# EAGLE design afraid_of_the_dark (EAGLE 6.4)
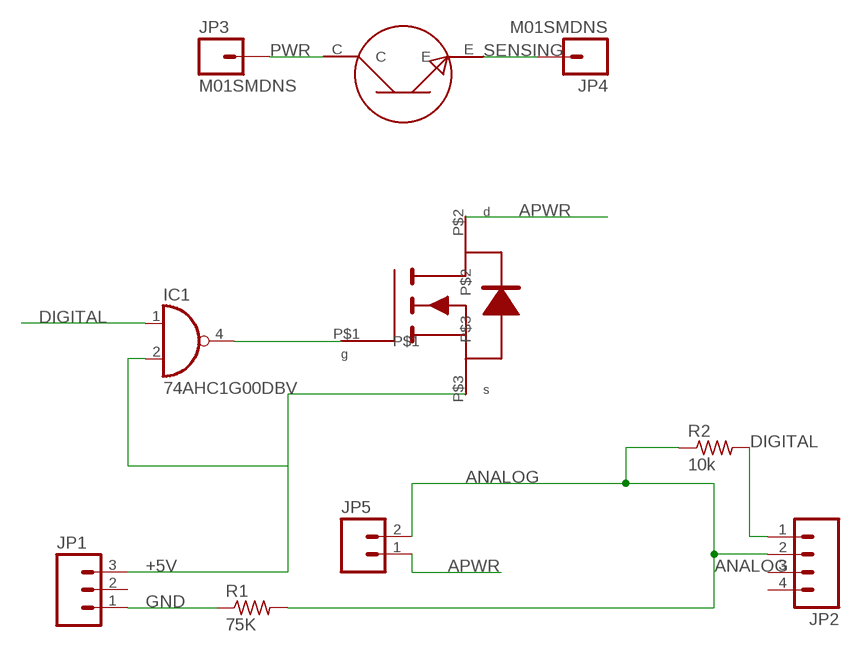
[diagram p0: schematic, sheet 1]

## Parts
IC1  74AHC1G00DBV  [SOT23-5]
JP1  M03PTH  [1X03]
JP2  M04PTH  [1X04]
JP3  M01SMDNS  [1X01NS]
JP4  M01SMDNS  [1X01NS]
JP5  M023.5MM  [SCREWTERMINAL-3.5MM-2]
R1  75K  R-US_R0805  [R0805]
R2  10k  R-US_R0805  [R0805]
U1  AMBIENT_LIGHT_SENSOR  [AMBIENT_LIGHT_SENSOR]
U3  SI2302DS_MOSFET  [SI2302DS_MOSFET]

## Nets
+5V: IC1.2(I1) JP1.3 U3.P$3
ANALOG: JP2.2 JP5.2 R1.2 R2.1
APWR: JP5.1 U3.P$2
DIGITAL: IC1.1(I0) JP2.1 R2.2
GND: JP1.1 R1.1
N$1: IC1.4(O) U3.P$1
PWR: JP3.1 U1.C
SENSING: JP4.1 U1.E
Unconnected: JP1.2 JP2.3 JP2.4

## Power pins joined to a net without a drawn wire
GND: IC1.3(GND)
VCC: IC1.5(VCC)

## Library data of the parts
IC1 = 74xx-little-de:74*1G00: 2-input NAND gate
JP1 = SparkFun:M03: Header 3 Standard 3-pin 0.1" header. Use with straight break away headers (SKU : PRT-00116), right angle break away headers (PRT-00553), swiss pins (PRT-00743), machine pins (PRT-00117), and female headers (PRT-00115). Molex polarized connector foot print use with SKU : PRT-08232 with associated crimp pins and housings.
JP2 = SparkFun:M04: Header 4 Standard 4-pin 0.1" header. Use with straight break away headers (SKU : PRT-00116), right angle break away headers (PRT-00553), swiss pins (PRT-00743), machine pins (PRT-00117), and female headers (PRT-00115). Molex polarized connector foot print use with SKU : PRT-08231 with associated crimp pins and housings. 1MM SMD Version SKU: PRT-10208
JP3 JP4 = SparkFun:M01: Header 1 Standard 1-pin 0.1" header. Use with straight break away headers (SKU : PRT-00116), right angle break away headers (PRT-00553), swiss pins (PRT-00743), machine pins (PRT-00117), and female headers (PRT-00115).
JP5 = SparkFun:M02: Header 2 Standard 2-pin 0.1" header. Use with straight break away headers (SKU : PRT-00116), right angle break away headers (PRT-00553), swiss pins (PRT-00743), machine pins (PRT-00117), and female headers (PRT-00115). Molex polarized connector foot print use with SKU : PRT-08233 with associated crimp pins and housings.
R1 R2 = rcl:R-US_: RESISTOR, American symbol
U1 = fabule:AMBIENT_LIGHT_SENSOR
U3 = fabule:SI2302DS_MOSFET

## Board
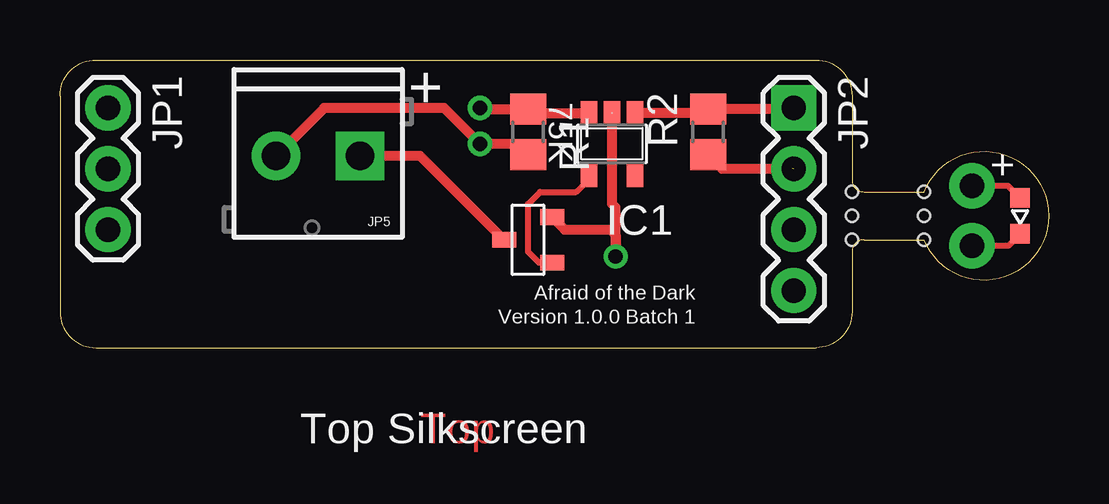
[diagram p1: board, top side]
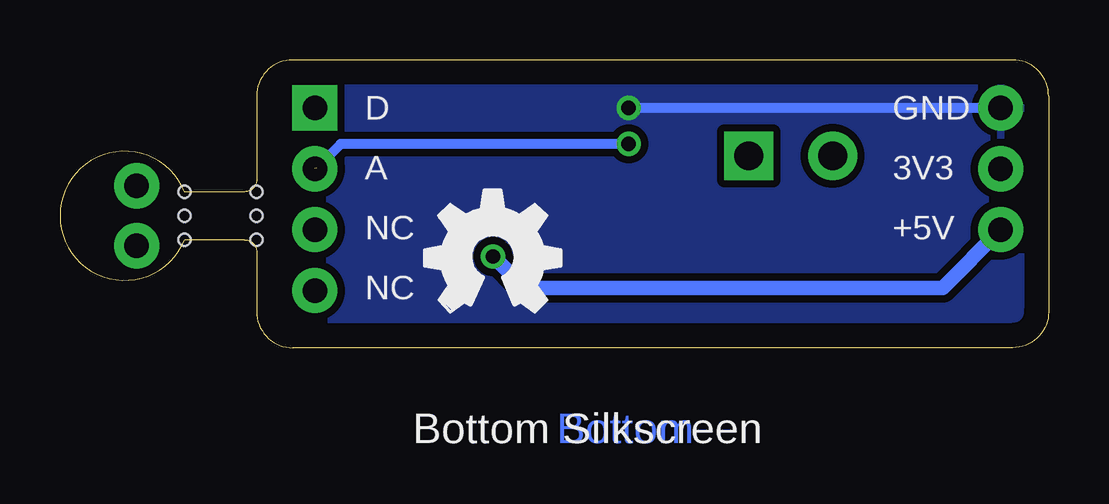
[diagram p2: board, bottom side, seen from below]

Size 41.19 x 12 mm. Coordinates in mm from the lower left corner, seen from the top.
Outline: 33,1.5 arc-90 31.5,0 1.5,0 arc-90 0,1.5 0,10.5 arc-90 1.5,12 31.5,12 arc-90 33,10.5 33,7 arc90 33.5,6.5 36,6.5 arc-316 36,4.5 33.5,4.5 arc90 33,4 33,1.5
Copper layers (1*16): Top 0.035mm / dielectric 1.5mm / Bottom 0.035mm
Design rules "default *": minimum track width 10mil, minimum drill 0.5mm, track to track 8mil, track to pad 8mil, pad to pad 8mil, via to via 8mil, smd to smd 8mil, copper to edge 40mil, drill to drill 8mil, minimum pad ring 10mil, minimum via ring 8mil, stop-mask expansion 4mil, vias tented up to drill 0.6mm, thermal gap 10mil
Holes 0.5 mm at 33,5.5 33,6.5 33,4.5 36,6.5 36,5.5 36,4.5

### Footprints (pad centres in the part's own frame; a part is rotated, then mirrored left to right if it is on the bottom)
SOT23-5 = smd 0.69 x 0.99: 1 -0.95,-1.29; 2 0,-1.29; 3 0.95,-1.29; 4 0.95,1.3; 5 -0.95,1.3
1X03 = drill 1.016 pad 1.88: 1 0,0; 2 2.54,0; 3 5.08,0
1X04 = drill 1.016 pad 1.88 square: 1 0,0 | drill 1.016 pad 1.88: 2 2.54,0; 3 5.08,0; 4 7.62,0
1X01NS = drill 1.016 pad 1.88: 1 0,0
SCREWTERMINAL-3.5MM-2 = drill 1.2 pad 2.032 square: 1 0,0 | drill 1.2 pad 2.032: 2 3.5,0
R0805 = smd 1.3 x 1.5: 1 -0.95,0; 2 0.95,0
AMBIENT_LIGHT_SENSOR = smd 0.8 x 0.8: C -0.75,0; E 0.75,0
SI2302DS_MOSFET = smd 0.65 x 1: P$1 -0.95,-1; P$2 0,1; P$3 0.95,-1

### Placement (x,y rotation side)
IC1  23,8.5 180 top
JP1  2,10 270 top
JP2  30.58,10 270 top
JP3  38,6.75 0 top
JP4  38,4.25 0 top
JP5  12.5,8 180 top
R1  19.5,9 270 top
R2  27,9 90 top
U1  40,5.5 270 top
U3  19.5,4.5 90 top
U$2  [OSHW_FILLX200_NOTEXT]  26,1.5 0 bottom

### Tracks (layer width: path | path; a pad name or v marks a point on that pad's centre or on a via)
+5V  (via drill 0.6)
  Top 0.406: U3.P$3 21.03,4.92 22.92,4.92 23.15,4.69 v23.15,3.8 23.15,5.85 23,6 IC1.2
  Bottom 0.61: JP1.3 4.42,2.5 21.85,2.5 v23.15,3.8
ANALOG  (via drill 0.6)  (1 unrouted)
  Top 0.406: R2.1 27.59,7.46 JP2.2 | R1.2 19.05,8.5 v17.5,8.5 16,10 11,10 JP5.2
  Bottom 0.406: v17.5,8.5 29.5,8.5 30.5,7.5
APWR
  Top 0.406: U3.P$2 15,8 JP5.1
DIGITAL
  Top 0.254: JP2.1 30.52,9.95 | R2.2 26.84,9.79
  Top 0.406: 30.52,9.95 R2.2 | 26.84,9.79 IC1.1
GND  (via drill 0.6)
  Top 0.254: R1.1 19.66,9.79
  Top 0.406: 19.66,9.79 IC1.3 | v17.5,10 17.55,9.95 R1.1
  Bottom 0.406: JP1.1 v17.5,10
  pour Bottom (isolate 0.305): -0.5,12.5 -0.5,-0.5 33.5,-0.5 33.5,12.5
N$1
  Top 0.254: U3.P$1 19.95,3.55 19.5,4 19.5,6 20,6.5 21.5,6.5 22.05,7.05 IC1.4
PWR
  Top 0.254: U1.C 39.5,6.75 JP3.1
SENSING
  Top 0.254: U1.E 39.5,4.25 JP4.1

### Text on the board
Top: Top
Bottom: Bottom
tPlace: + | 75K | + | Top Silkscreen
bPlace: Bottom Silkscreen
tStop: Top Solder Stop Mask
bStop: Bottom Solder Stop Mask
tCream: Top Paste Mask
tDesignators: R1 | IC1 | R2 | U3 | U1
tSilkscreen: Afraid of the Dark | Version 1.0.0 Batch 1
bSilkscreen: GND | D | 3V3 | A | +5V | NC | NC